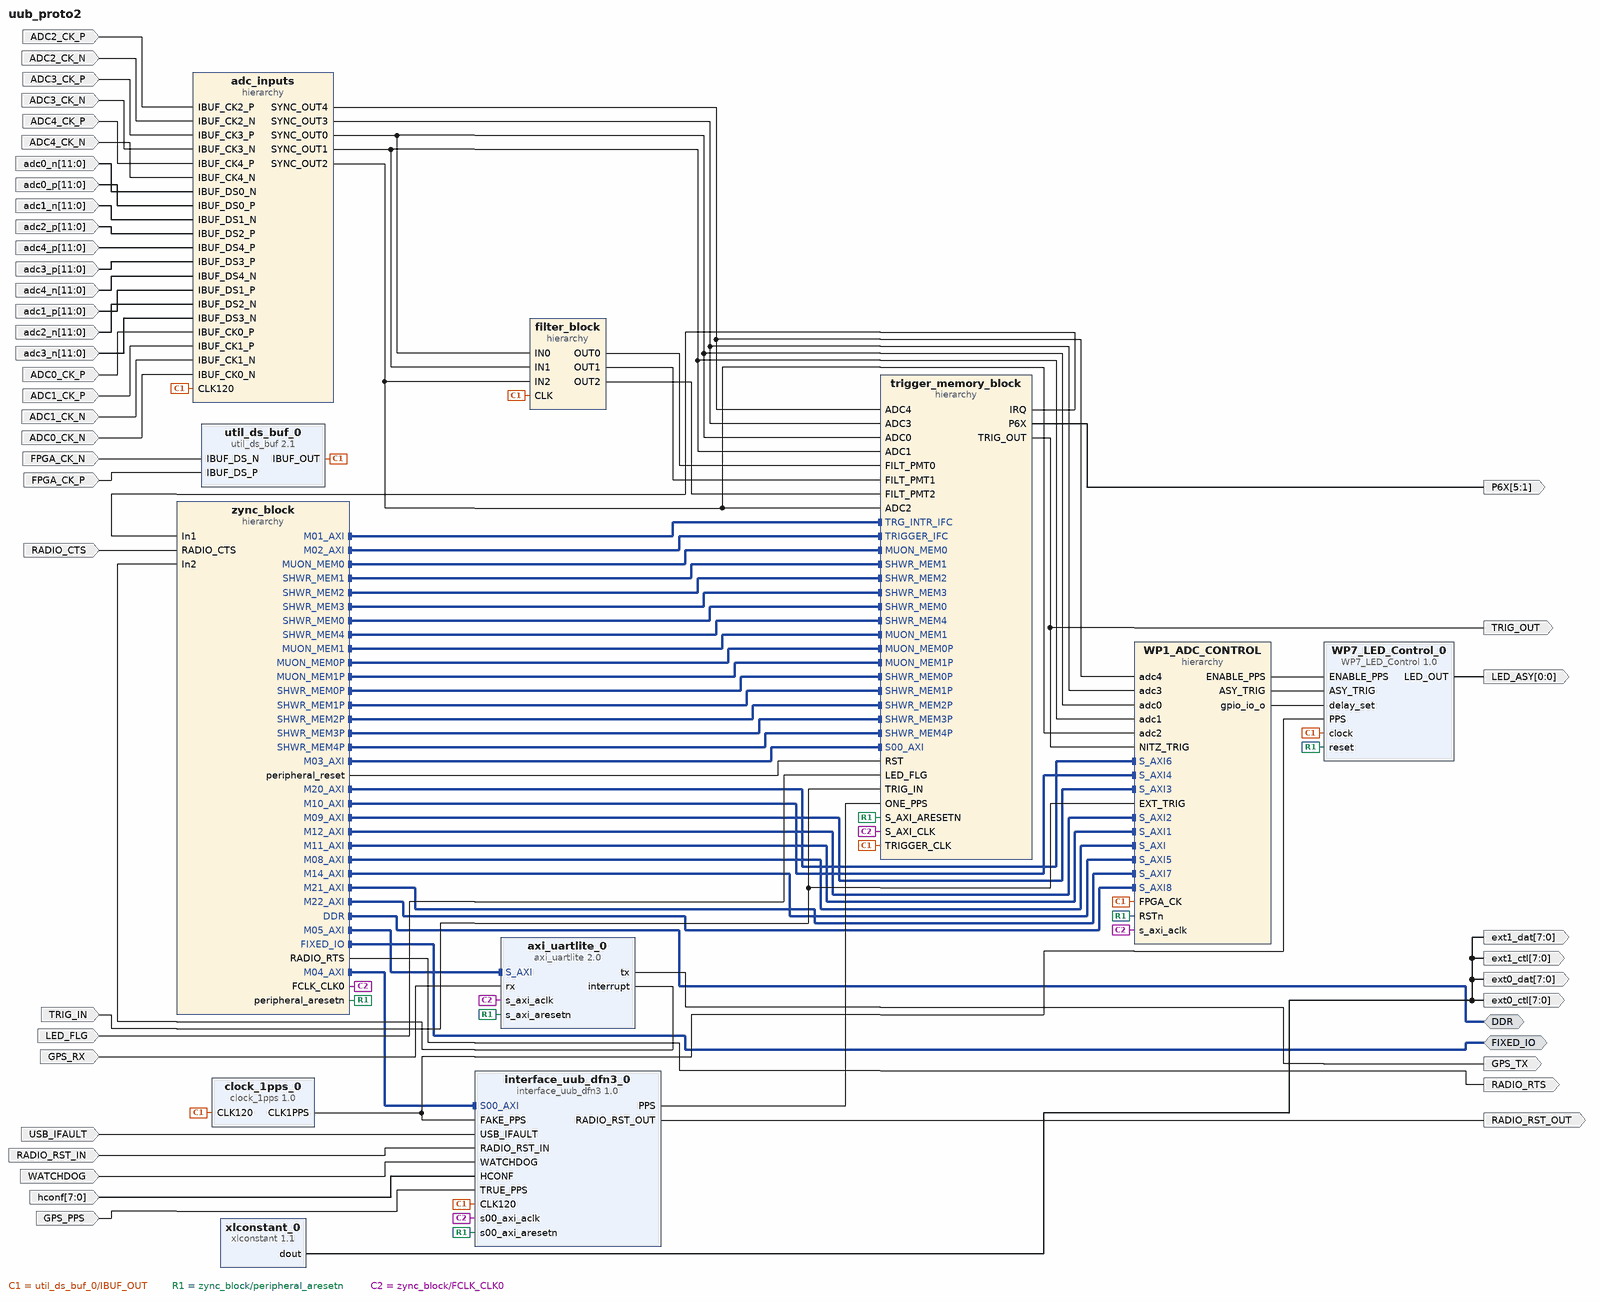
[diagram p0: block diagram of the top level]
# Vivado block design uub_proto2, Vivado 2015.2.1
create_bd_design uub_proto2

create_bd_intf_port -mode Master -vlnv xilinx.com:interface:ddrx_rtl:1.0 DDR
create_bd_intf_port -mode Master -vlnv xilinx.com:display_processing_system7:fixedio_rtl:1.0 FIXED_IO
create_bd_port -dir I -type clk FPGA_CK_N
set_property -dict {CONFIG.FREQ_HZ 120000000} [get_bd_ports FPGA_CK_N]
create_bd_port -dir I -type clk FPGA_CK_P
set_property -dict {CONFIG.FREQ_HZ 120000000} [get_bd_ports FPGA_CK_P]
create_bd_port -dir I RADIO_CTS
create_bd_port -dir O GPS_TX
create_bd_port -dir I GPS_RX
create_bd_port -dir O RADIO_RTS
create_bd_port -dir I -type clk ADC2_CK_P
set_property -dict {CONFIG.FREQ_HZ 120000000} [get_bd_ports ADC2_CK_P]
create_bd_port -dir I -type clk ADC2_CK_N
set_property -dict {CONFIG.FREQ_HZ 120000000} [get_bd_ports ADC2_CK_N]
create_bd_port -dir I -type clk ADC3_CK_P
set_property -dict {CONFIG.FREQ_HZ 120000000} [get_bd_ports ADC3_CK_P]
create_bd_port -dir I -type clk ADC3_CK_N
set_property -dict {CONFIG.FREQ_HZ 120000000} [get_bd_ports ADC3_CK_N]
create_bd_port -dir I -type clk ADC4_CK_P
set_property -dict {CONFIG.FREQ_HZ 120000000} [get_bd_ports ADC4_CK_P]
create_bd_port -dir I -type clk ADC4_CK_N
set_property -dict {CONFIG.FREQ_HZ 120000000} [get_bd_ports ADC4_CK_N]
create_bd_port -dir I -from 11 -to 0 adc0_n
create_bd_port -dir I -from 11 -to 0 adc0_p
create_bd_port -dir I -from 11 -to 0 -type data adc1_n
create_bd_port -dir I -from 11 -to 0 -type data adc2_p
create_bd_port -dir I -from 11 -to 0 -type data adc4_p
create_bd_port -dir I -from 11 -to 0 -type data adc3_p
create_bd_port -dir I -from 11 -to 0 -type data adc4_n
create_bd_port -dir I -from 11 -to 0 -type data adc1_p
create_bd_port -dir I -from 11 -to 0 -type data adc2_n
create_bd_port -dir I -from 11 -to 0 -type data adc3_n
create_bd_port -dir I TRIG_IN
create_bd_port -dir I -type clk ADC0_CK_P
set_property -dict {CONFIG.FREQ_HZ 120000000} [get_bd_ports ADC0_CK_P]
create_bd_port -dir I -type clk ADC1_CK_P
set_property -dict {CONFIG.FREQ_HZ 120000000} [get_bd_ports ADC1_CK_P]
create_bd_port -dir I -type clk ADC1_CK_N
set_property -dict {CONFIG.FREQ_HZ 120000000} [get_bd_ports ADC1_CK_N]
create_bd_port -dir I -type clk ADC0_CK_N
set_property -dict {CONFIG.FREQ_HZ 120000000} [get_bd_ports ADC0_CK_N]
create_bd_port -dir O -from 7 -to 0 ext1_ctl
create_bd_port -dir O -from 7 -to 0 ext0_ctl
create_bd_port -dir O -from 7 -to 0 ext1_dat
create_bd_port -dir O -from 7 -to 0 ext0_dat
create_bd_port -dir O -from 5 -to 1 P6X
create_bd_port -dir I USB_IFAULT
create_bd_port -dir I RADIO_RST_IN
create_bd_port -dir I WATCHDOG
create_bd_port -dir I -from 7 -to 0 hconf
create_bd_port -dir O RADIO_RST_OUT
create_bd_port -dir I GPS_PPS
create_bd_port -dir O -from 0 -to 0 LED_ASY
create_bd_port -dir I LED_FLG
create_bd_port -dir O TRIG_OUT

create_bd_cell -type hier zync_block
create_bd_cell -type ip -vlnv xilinx.com:ip:axi_uartlite:2.0 axi_uartlite_0
create_bd_cell -type ip -vlnv auger.org:dfnitz:clock_1pps:1.0 clock_1pps_0
create_bd_cell -type ip -vlnv xilinx.com:ip:util_ds_buf:2.1 util_ds_buf_0
set_property -dict {CONFIG.C_BUF_TYPE IBUFDS} [get_bd_cells util_ds_buf_0]
create_bd_cell -type hier adc_inputs
create_bd_cell -type hier trigger_memory_block
create_bd_cell -type ip -vlnv xilinx.com:ip:xlconstant:1.1 xlconstant_0
set_property -dict {CONFIG.CONST_WIDTH 8 CONFIG.CONST_VAL 170} [get_bd_cells xlconstant_0]
create_bd_cell -type hier filter_block
create_bd_cell -type ip -vlnv auger.org:auger:interface_uub_dfn3:1.0 interface_uub_dfn3_0
create_bd_cell -type hier WP1_ADC_CONTROL
create_bd_cell -type ip -vlnv elettronica.le.infn.it:user:WP7_LED_Control:1.0 WP7_LED_Control_0

# ---- hierarchy /zync_block ----
current_bd_instance /zync_block
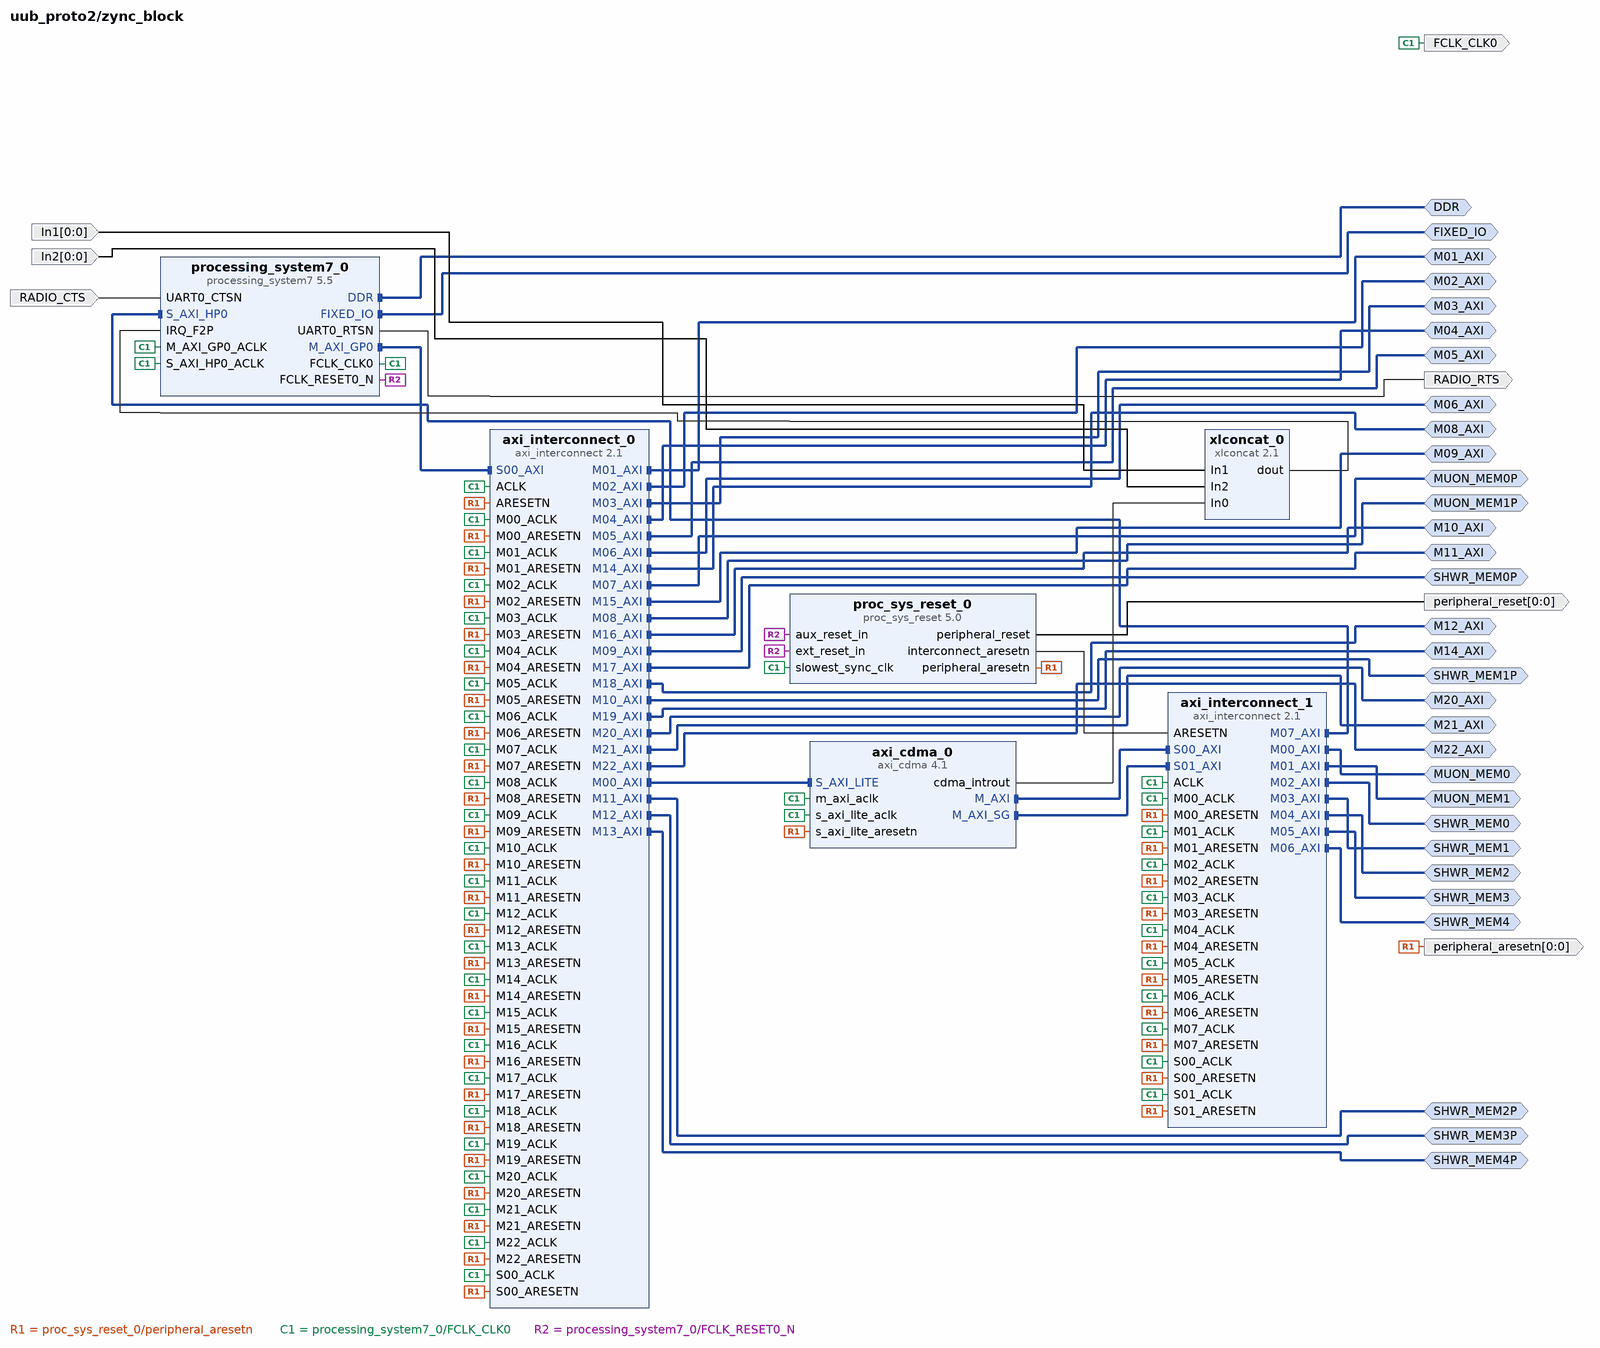
[diagram p1: block diagram inside /zync_block]
create_bd_intf_pin -mode Master -vlnv xilinx.com:interface:ddrx_rtl:1.0 DDR
create_bd_intf_pin -mode Master -vlnv xilinx.com:display_processing_system7:fixedio_rtl:1.0 FIXED_IO
create_bd_intf_pin -mode Master -vlnv xilinx.com:interface:aximm_rtl:1.0 M01_AXI
create_bd_intf_pin -mode Master -vlnv xilinx.com:interface:aximm_rtl:1.0 MUON_MEM0
create_bd_intf_pin -mode Master -vlnv xilinx.com:interface:aximm_rtl:1.0 M02_AXI
create_bd_intf_pin -mode Master -vlnv xilinx.com:interface:aximm_rtl:1.0 SHWR_MEM0
create_bd_intf_pin -mode Master -vlnv xilinx.com:interface:aximm_rtl:1.0 M03_AXI
create_bd_intf_pin -mode Master -vlnv xilinx.com:interface:aximm_rtl:1.0 SHWR_MEM1
create_bd_intf_pin -mode Master -vlnv xilinx.com:interface:aximm_rtl:1.0 M04_AXI
create_bd_intf_pin -mode Master -vlnv xilinx.com:interface:aximm_rtl:1.0 SHWR_MEM2
create_bd_intf_pin -mode Master -vlnv xilinx.com:interface:aximm_rtl:1.0 M05_AXI
create_bd_intf_pin -mode Master -vlnv xilinx.com:interface:aximm_rtl:1.0 SHWR_MEM3
create_bd_intf_pin -mode Master -vlnv xilinx.com:interface:aximm_rtl:1.0 M06_AXI
create_bd_intf_pin -mode Master -vlnv xilinx.com:interface:aximm_rtl:1.0 SHWR_MEM4
create_bd_intf_pin -mode Master -vlnv xilinx.com:interface:aximm_rtl:1.0 MUON_MEM1
create_bd_intf_pin -mode Master -vlnv xilinx.com:interface:aximm_rtl:1.0 MUON_MEM0P
create_bd_intf_pin -mode Master -vlnv xilinx.com:interface:aximm_rtl:1.0 MUON_MEM1P
create_bd_intf_pin -mode Master -vlnv xilinx.com:interface:aximm_rtl:1.0 SHWR_MEM0P
create_bd_intf_pin -mode Master -vlnv xilinx.com:interface:aximm_rtl:1.0 SHWR_MEM1P
create_bd_intf_pin -mode Master -vlnv xilinx.com:interface:aximm_rtl:1.0 SHWR_MEM2P
create_bd_intf_pin -mode Master -vlnv xilinx.com:interface:aximm_rtl:1.0 SHWR_MEM3P
create_bd_intf_pin -mode Master -vlnv xilinx.com:interface:aximm_rtl:1.0 SHWR_MEM4P
create_bd_intf_pin -mode Master -vlnv xilinx.com:interface:aximm_rtl:1.0 M08_AXI
create_bd_intf_pin -mode Master -vlnv xilinx.com:interface:aximm_rtl:1.0 M09_AXI
create_bd_intf_pin -mode Master -vlnv xilinx.com:interface:aximm_rtl:1.0 M10_AXI
create_bd_intf_pin -mode Master -vlnv xilinx.com:interface:aximm_rtl:1.0 M11_AXI
create_bd_intf_pin -mode Master -vlnv xilinx.com:interface:aximm_rtl:1.0 M12_AXI
create_bd_intf_pin -mode Master -vlnv xilinx.com:interface:aximm_rtl:1.0 M14_AXI
create_bd_intf_pin -mode Master -vlnv xilinx.com:interface:aximm_rtl:1.0 M20_AXI
create_bd_intf_pin -mode Master -vlnv xilinx.com:interface:aximm_rtl:1.0 M21_AXI
create_bd_intf_pin -mode Master -vlnv xilinx.com:interface:aximm_rtl:1.0 M22_AXI
create_bd_pin -dir O -type clk FCLK_CLK0
create_bd_pin -dir I -from 0 -to 0 In1
create_bd_pin -dir I RADIO_CTS
create_bd_pin -dir O RADIO_RTS
create_bd_pin -dir O -from 0 -to 0 -type rst peripheral_aresetn
create_bd_pin -dir O -from 0 -to 0 -type rst peripheral_reset
create_bd_pin -dir I -from 0 -to 0 In2

create_bd_cell -type ip -vlnv xilinx.com:ip:axi_interconnect:2.1 axi_interconnect_1
set_property -dict {CONFIG.NUM_SI 2 CONFIG.NUM_MI 8 CONFIG.ENABLE_ADVANCED_OPTIONS 0} [get_bd_cells axi_interconnect_1]
create_bd_cell -type ip -vlnv xilinx.com:ip:proc_sys_reset:5.0 proc_sys_reset_0
create_bd_cell -type ip -vlnv xilinx.com:ip:processing_system7:5.5 processing_system7_0
set_property -dict [list \
  CONFIG.PCW_UIPARAM_DDR_FREQ_MHZ 400 \
  CONFIG.PCW_CRYSTAL_PERIPHERAL_FREQMHZ 50 \
  CONFIG.PCW_APU_PERIPHERAL_FREQMHZ 333.5 \
  CONFIG.PCW_QSPI_PERIPHERAL_FREQMHZ 60 \
  CONFIG.PCW_SPI_PERIPHERAL_FREQMHZ 100 \
  CONFIG.PCW_FPGA0_PERIPHERAL_FREQMHZ 50 \
  CONFIG.PCW_FPGA1_PERIPHERAL_FREQMHZ 200.000000 \
  CONFIG.PCW_USE_S_AXI_HP0 1 \
  CONFIG.PCW_USE_FABRIC_INTERRUPT 1 \
  CONFIG.PCW_USE_EXPANDED_IOP 1 \
  CONFIG.PCW_UART0_BAUD_RATE 9600 \
  CONFIG.PCW_EN_CLK1_PORT 1 \
  CONFIG.PCW_IRQ_F2P_INTR 1 \
  CONFIG.PCW_IMPORT_BOARD_PRESET Z:/cao-projets/SPB16X/lagorio/Auger/Document_travail/xilinx/edk_20140221/ps7_system_prj.xml \
  CONFIG.PCW_PRESET_BANK1_VOLTAGE {LVCMOS 1.8V} \
  CONFIG.PCW_UIPARAM_DDR_MEMORY_TYPE {LPDDR 2} \
  CONFIG.PCW_UIPARAM_DDR_PARTNO Custom \
  CONFIG.PCW_QSPI_PERIPHERAL_ENABLE 1 \
  CONFIG.PCW_QSPI_GRP_SINGLE_SS_ENABLE 0 \
  CONFIG.PCW_QSPI_GRP_SS1_ENABLE 1 \
  CONFIG.PCW_ENET0_PERIPHERAL_ENABLE 1 \
  CONFIG.PCW_ENET0_ENET0_IO {MIO 16 .. 27} \
  CONFIG.PCW_ENET0_GRP_MDIO_ENABLE 1 \
  CONFIG.PCW_ENET0_RESET_ENABLE 1 \
  CONFIG.PCW_ENET0_RESET_IO {MIO 50} \
  CONFIG.PCW_UART0_PERIPHERAL_ENABLE 1 \
  CONFIG.PCW_UART0_UART0_IO {MIO 46 .. 47} \
  CONFIG.PCW_UART0_GRP_FULL_ENABLE 1 \
  CONFIG.PCW_UART1_PERIPHERAL_ENABLE 1 \
  CONFIG.PCW_UART1_UART1_IO {MIO 8 .. 9} \
  CONFIG.PCW_SPI0_PERIPHERAL_ENABLE 1 \
  CONFIG.PCW_SPI0_SPI0_IO {MIO 40 .. 45} \
  CONFIG.PCW_SPI0_GRP_SS1_ENABLE 1 \
  CONFIG.PCW_SPI0_GRP_SS2_ENABLE 1 \
  CONFIG.PCW_SPI1_PERIPHERAL_ENABLE 1 \
  CONFIG.PCW_SPI1_SPI1_IO {MIO 10 .. 15} \
  CONFIG.PCW_TTC0_PERIPHERAL_ENABLE 1 \
  CONFIG.PCW_USB0_PERIPHERAL_ENABLE 1 \
  CONFIG.PCW_USB0_RESET_ENABLE 1 \
  CONFIG.PCW_USB0_RESET_IO {MIO 51} \
  CONFIG.PCW_I2C0_PERIPHERAL_ENABLE 1 \
  CONFIG.PCW_I2C0_I2C0_IO {MIO 14 .. 15} \
  CONFIG.PCW_I2C1_PERIPHERAL_ENABLE 1 \
  CONFIG.PCW_I2C1_I2C1_IO {MIO 48 .. 49} \
  CONFIG.PCW_I2C_RESET_ENABLE 0 \
  CONFIG.PCW_GPIO_MIO_GPIO_ENABLE 1 \
] [get_bd_cells processing_system7_0]
# 82 more settings of processing_system7_0 are not shown: defaults, MIO pin electricals, DDR timing, and values the tool derives
create_bd_cell -type ip -vlnv xilinx.com:ip:xlconcat:2.1 xlconcat_0
set_property -dict {CONFIG.NUM_PORTS 3} [get_bd_cells xlconcat_0]
create_bd_cell -type ip -vlnv xilinx.com:ip:axi_cdma:4.1 axi_cdma_0
create_bd_cell -type ip -vlnv xilinx.com:ip:axi_interconnect:2.1 axi_interconnect_0
set_property -dict {CONFIG.NUM_MI 23} [get_bd_cells axi_interconnect_0]

# ---- hierarchy /adc_inputs ----
current_bd_instance /adc_inputs
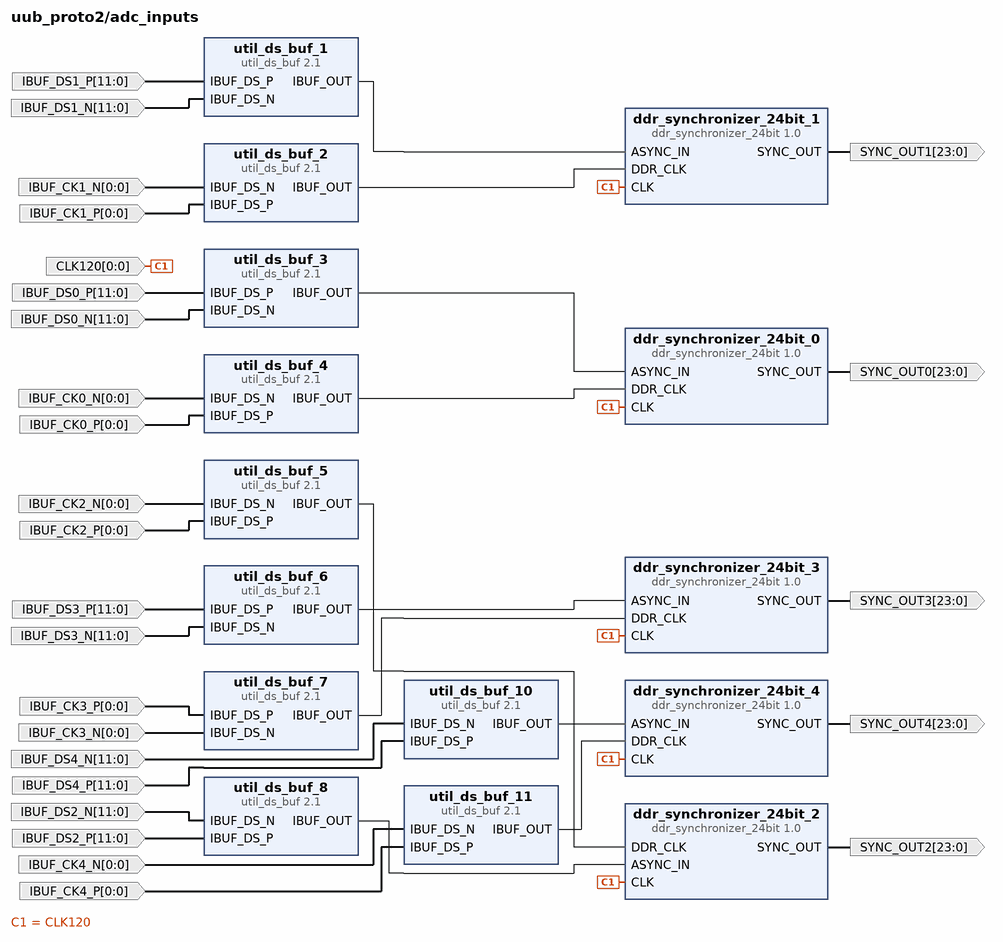
[diagram p2: block diagram inside /adc_inputs]
create_bd_pin -dir I -from 0 -to 0 -type clk CLK120
create_bd_pin -dir I -from 11 -to 0 IBUF_DS2_N
create_bd_pin -dir I -from 11 -to 0 IBUF_DS1_P
create_bd_pin -dir I -from 11 -to 0 IBUF_DS4_N
create_bd_pin -dir I -from 11 -to 0 IBUF_DS3_P
create_bd_pin -dir I -from 11 -to 0 IBUF_DS0_P
create_bd_pin -dir I -from 0 -to 0 IBUF_CK4_N
create_bd_pin -dir I -from 0 -to 0 IBUF_CK3_P
create_bd_pin -dir I -from 0 -to 0 IBUF_CK2_N
create_bd_pin -dir I -from 0 -to 0 IBUF_CK2_P
create_bd_pin -dir O -from 23 -to 0 SYNC_OUT0
create_bd_pin -dir I -from 0 -to 0 IBUF_CK1_N
create_bd_pin -dir I -from 0 -to 0 IBUF_CK4_P
create_bd_pin -dir O -from 23 -to 0 SYNC_OUT3
create_bd_pin -dir I -from 11 -to 0 IBUF_DS3_N
create_bd_pin -dir O -from 23 -to 0 SYNC_OUT1
create_bd_pin -dir I -from 11 -to 0 IBUF_DS0_N
create_bd_pin -dir I -from 0 -to 0 IBUF_CK3_N
create_bd_pin -dir O -from 23 -to 0 SYNC_OUT2
create_bd_pin -dir O -from 23 -to 0 SYNC_OUT4
create_bd_pin -dir I -from 11 -to 0 IBUF_DS2_P
create_bd_pin -dir I -from 0 -to 0 IBUF_CK0_N
create_bd_pin -dir I -from 11 -to 0 IBUF_DS1_N
create_bd_pin -dir I -from 0 -to 0 IBUF_CK1_P
create_bd_pin -dir I -from 0 -to 0 IBUF_CK0_P
create_bd_pin -dir I -from 11 -to 0 IBUF_DS4_P

create_bd_cell -type ip -vlnv xilinx.com:ip:util_ds_buf:2.1 util_ds_buf_5
create_bd_cell -type ip -vlnv xilinx.com:ip:util_ds_buf:2.1 util_ds_buf_7
create_bd_cell -type ip -vlnv xilinx.com:ip:util_ds_buf:2.1 util_ds_buf_11
create_bd_cell -type ip -vlnv xilinx.com:ip:util_ds_buf:2.1 util_ds_buf_8
set_property -dict {CONFIG.C_SIZE 12} [get_bd_cells util_ds_buf_8]
create_bd_cell -type ip -vlnv xilinx.com:ip:util_ds_buf:2.1 util_ds_buf_6
set_property -dict {CONFIG.C_SIZE 12} [get_bd_cells util_ds_buf_6]
create_bd_cell -type ip -vlnv xilinx.com:ip:util_ds_buf:2.1 util_ds_buf_10
set_property -dict {CONFIG.C_SIZE 12} [get_bd_cells util_ds_buf_10]
create_bd_cell -type ip -vlnv xilinx.com:ip:util_ds_buf:2.1 util_ds_buf_2
create_bd_cell -type ip -vlnv xilinx.com:ip:util_ds_buf:2.1 util_ds_buf_4
create_bd_cell -type ip -vlnv xilinx.com:ip:util_ds_buf:2.1 util_ds_buf_1
set_property -dict {CONFIG.C_SIZE 12} [get_bd_cells util_ds_buf_1]
create_bd_cell -type ip -vlnv xilinx.com:ip:util_ds_buf:2.1 util_ds_buf_3
set_property -dict {CONFIG.C_SIZE 12} [get_bd_cells util_ds_buf_3]
create_bd_cell -type ip -vlnv auger.org:auger:ddr_synchronizer_24bit:1.0 ddr_synchronizer_24bit_0
create_bd_cell -type ip -vlnv auger.org:auger:ddr_synchronizer_24bit:1.0 ddr_synchronizer_24bit_1
create_bd_cell -type ip -vlnv auger.org:auger:ddr_synchronizer_24bit:1.0 ddr_synchronizer_24bit_2
create_bd_cell -type ip -vlnv auger.org:auger:ddr_synchronizer_24bit:1.0 ddr_synchronizer_24bit_3
create_bd_cell -type ip -vlnv auger.org:auger:ddr_synchronizer_24bit:1.0 ddr_synchronizer_24bit_4

# ---- hierarchy /trigger_memory_block ----
current_bd_instance /trigger_memory_block
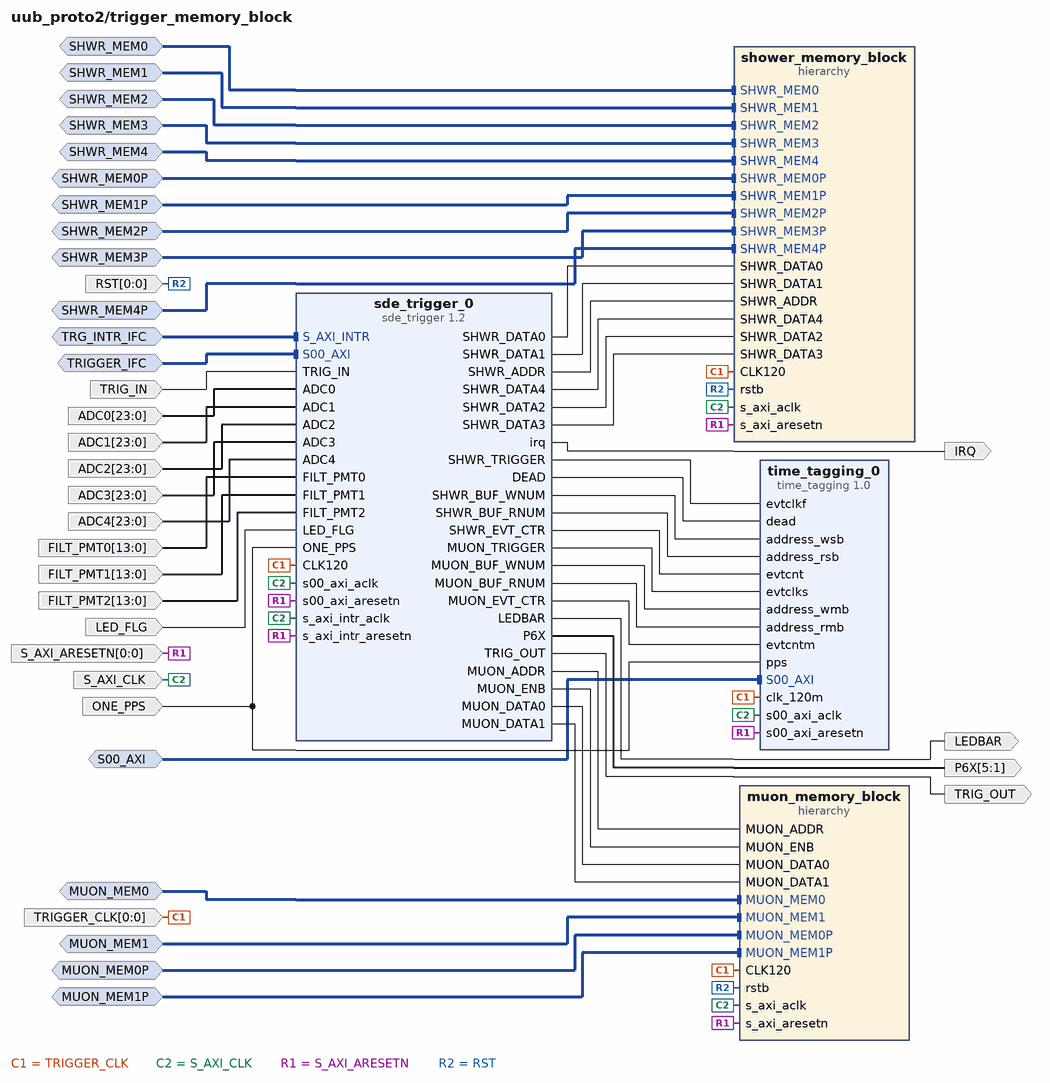
[diagram p3: block diagram inside /trigger_memory_block]
create_bd_intf_pin -mode Slave -vlnv xilinx.com:interface:aximm_rtl:1.0 MUON_MEM0
create_bd_intf_pin -mode Slave -vlnv xilinx.com:interface:aximm_rtl:1.0 SHWR_MEM0
create_bd_intf_pin -mode Slave -vlnv xilinx.com:interface:aximm_rtl:1.0 SHWR_MEM1
create_bd_intf_pin -mode Slave -vlnv xilinx.com:interface:aximm_rtl:1.0 SHWR_MEM2
create_bd_intf_pin -mode Slave -vlnv xilinx.com:interface:aximm_rtl:1.0 SHWR_MEM3
create_bd_intf_pin -mode Slave -vlnv xilinx.com:interface:aximm_rtl:1.0 TRG_INTR_IFC
create_bd_intf_pin -mode Slave -vlnv xilinx.com:interface:aximm_rtl:1.0 TRIGGER_IFC
create_bd_intf_pin -mode Slave -vlnv xilinx.com:interface:aximm_rtl:1.0 SHWR_MEM4
create_bd_intf_pin -mode Slave -vlnv xilinx.com:interface:aximm_rtl:1.0 MUON_MEM1
create_bd_intf_pin -mode Slave -vlnv xilinx.com:interface:aximm_rtl:1.0 MUON_MEM0P
create_bd_intf_pin -mode Slave -vlnv xilinx.com:interface:aximm_rtl:1.0 MUON_MEM1P
create_bd_intf_pin -mode Slave -vlnv xilinx.com:interface:aximm_rtl:1.0 SHWR_MEM0P
create_bd_intf_pin -mode Slave -vlnv xilinx.com:interface:aximm_rtl:1.0 SHWR_MEM1P
create_bd_intf_pin -mode Slave -vlnv xilinx.com:interface:aximm_rtl:1.0 SHWR_MEM2P
create_bd_intf_pin -mode Slave -vlnv xilinx.com:interface:aximm_rtl:1.0 SHWR_MEM3P
create_bd_intf_pin -mode Slave -vlnv xilinx.com:interface:aximm_rtl:1.0 SHWR_MEM4P
create_bd_intf_pin -mode Slave -vlnv xilinx.com:interface:aximm_rtl:1.0 S00_AXI
create_bd_pin -dir I -type clk S_AXI_CLK
create_bd_pin -dir I -from 0 -to 0 -type rst RST
create_bd_pin -dir I -from 0 -to 0 -type rst S_AXI_ARESETN
create_bd_pin -dir I -from 0 -to 0 TRIGGER_CLK
create_bd_pin -dir O -type intr IRQ
create_bd_pin -dir I TRIG_IN
create_bd_pin -dir O TRIG_OUT
create_bd_pin -dir I -from 23 -to 0 ADC0
create_bd_pin -dir I -from 23 -to 0 ADC1
create_bd_pin -dir I -from 23 -to 0 ADC2
create_bd_pin -dir I -from 23 -to 0 ADC3
create_bd_pin -dir I -from 23 -to 0 ADC4
create_bd_pin -dir O -from 5 -to 1 P6X
create_bd_pin -dir I -from 13 -to 0 FILT_PMT0
create_bd_pin -dir I -from 13 -to 0 FILT_PMT1
create_bd_pin -dir I -from 13 -to 0 FILT_PMT2
create_bd_pin -dir I ONE_PPS
create_bd_pin -dir I LED_FLG
create_bd_pin -dir O LEDBAR

create_bd_cell -type hier muon_memory_block
create_bd_cell -type hier shower_memory_block
create_bd_cell -type ip -vlnv auger.mtu.edu:user:sde_trigger:1.2 sde_trigger_0
create_bd_cell -type ip -vlnv xilinx.com:user:time_tagging:1.0 time_tagging_0

# ---- hierarchy /trigger_memory_block/muon_memory_block ----
current_bd_instance /trigger_memory_block/muon_memory_block
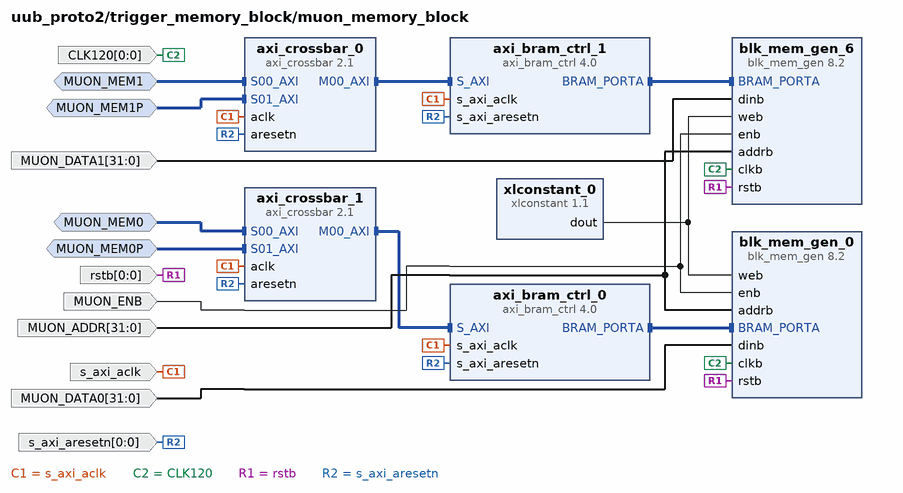
[diagram p4: block diagram inside /trigger_memory_block/muon_memory_block]
create_bd_intf_pin -mode Slave -vlnv xilinx.com:interface:aximm_rtl:1.0 MUON_MEM0
create_bd_intf_pin -mode Slave -vlnv xilinx.com:interface:aximm_rtl:1.0 MUON_MEM1
create_bd_intf_pin -mode Slave -vlnv xilinx.com:interface:aximm_rtl:1.0 MUON_MEM0P
create_bd_intf_pin -mode Slave -vlnv xilinx.com:interface:aximm_rtl:1.0 MUON_MEM1P
create_bd_pin -dir I -type clk s_axi_aclk
create_bd_pin -dir I -from 0 -to 0 CLK120
create_bd_pin -dir I MUON_ENB
create_bd_pin -dir I -from 31 -to 0 MUON_ADDR
create_bd_pin -dir I -from 0 -to 0 -type rst s_axi_aresetn
create_bd_pin -dir I -from 31 -to 0 MUON_DATA1
create_bd_pin -dir I -from 31 -to 0 MUON_DATA0
create_bd_pin -dir I -from 0 -to 0 rstb

create_bd_cell -type ip -vlnv xilinx.com:ip:axi_bram_ctrl:4.0 axi_bram_ctrl_0
set_property -dict {CONFIG.SINGLE_PORT_BRAM 1} [get_bd_cells axi_bram_ctrl_0]
create_bd_cell -type ip -vlnv xilinx.com:ip:axi_bram_ctrl:4.0 axi_bram_ctrl_1
set_property -dict {CONFIG.SINGLE_PORT_BRAM 1} [get_bd_cells axi_bram_ctrl_1]
create_bd_cell -type ip -vlnv xilinx.com:ip:blk_mem_gen:8.2 blk_mem_gen_0
set_property -dict [list \
  CONFIG.Memory_Type True_Dual_Port_RAM \
  CONFIG.Enable_B Use_ENB_Pin \
  CONFIG.Use_RSTB_Pin true \
  CONFIG.Port_B_Clock 100 \
  CONFIG.Port_B_Write_Rate 50 \
  CONFIG.Port_B_Enable_Rate 100 \
] [get_bd_cells blk_mem_gen_0]
create_bd_cell -type ip -vlnv xilinx.com:ip:blk_mem_gen:8.2 blk_mem_gen_6
set_property -dict [list \
  CONFIG.Memory_Type True_Dual_Port_RAM \
  CONFIG.Enable_B Use_ENB_Pin \
  CONFIG.Use_RSTB_Pin true \
  CONFIG.Port_B_Clock 100 \
  CONFIG.Port_B_Write_Rate 50 \
  CONFIG.Port_B_Enable_Rate 100 \
] [get_bd_cells blk_mem_gen_6]
create_bd_cell -type ip -vlnv xilinx.com:ip:xlconstant:1.1 xlconstant_0
set_property -dict {CONFIG.CONST_WIDTH 4 CONFIG.CONST_VAL 15} [get_bd_cells xlconstant_0]
create_bd_cell -type ip -vlnv xilinx.com:ip:axi_crossbar:2.1 axi_crossbar_0
set_property -dict {CONFIG.NUM_SI 2 CONFIG.NUM_MI 1 CONFIG.DATA_WIDTH 32} [get_bd_cells axi_crossbar_0]
create_bd_cell -type ip -vlnv xilinx.com:ip:axi_crossbar:2.1 axi_crossbar_1
set_property -dict {CONFIG.NUM_SI 2 CONFIG.NUM_MI 1 CONFIG.DATA_WIDTH 32} [get_bd_cells axi_crossbar_1]

# ---- hierarchy /trigger_memory_block/shower_memory_block ----
current_bd_instance /trigger_memory_block/shower_memory_block
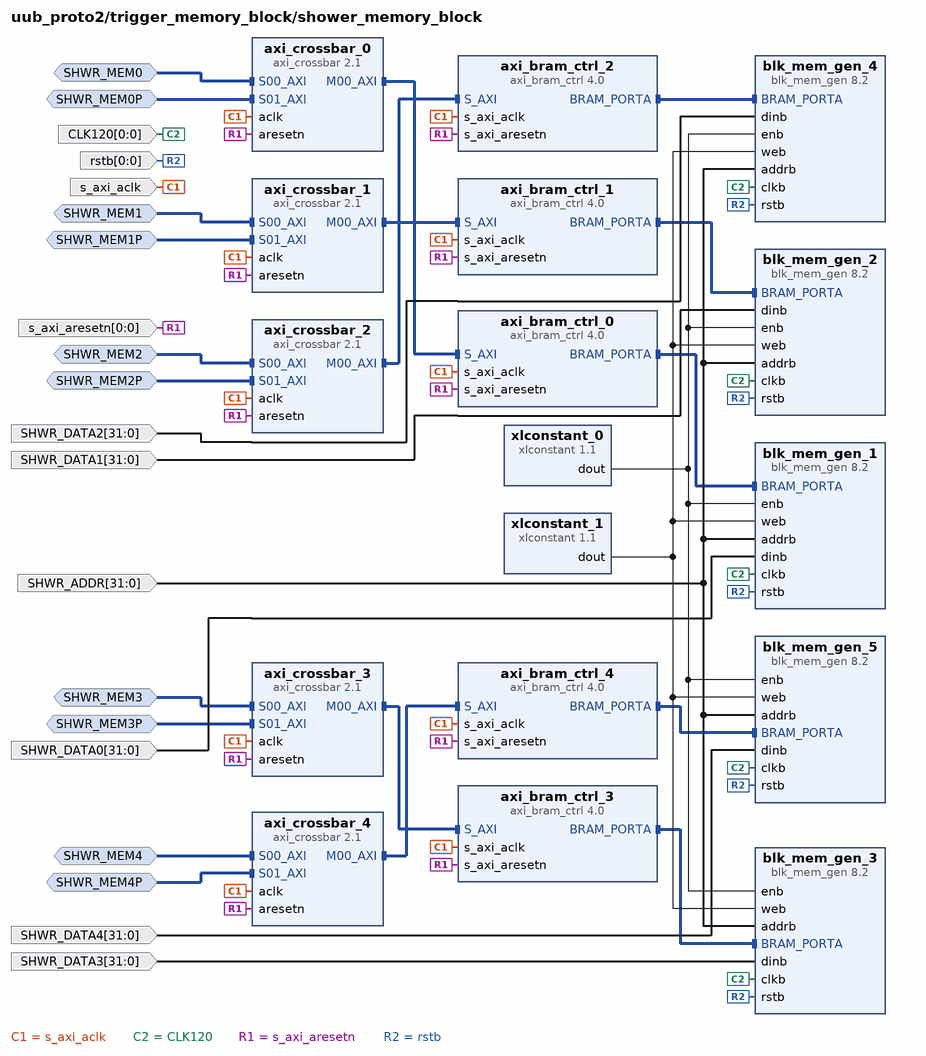
[diagram p5: block diagram inside /trigger_memory_block/shower_memory_block]
create_bd_intf_pin -mode Slave -vlnv xilinx.com:interface:aximm_rtl:1.0 SHWR_MEM0
create_bd_intf_pin -mode Slave -vlnv xilinx.com:interface:aximm_rtl:1.0 SHWR_MEM1
create_bd_intf_pin -mode Slave -vlnv xilinx.com:interface:aximm_rtl:1.0 SHWR_MEM2
create_bd_intf_pin -mode Slave -vlnv xilinx.com:interface:aximm_rtl:1.0 SHWR_MEM3
create_bd_intf_pin -mode Slave -vlnv xilinx.com:interface:aximm_rtl:1.0 SHWR_MEM4
create_bd_intf_pin -mode Slave -vlnv xilinx.com:interface:aximm_rtl:1.0 SHWR_MEM0P
create_bd_intf_pin -mode Slave -vlnv xilinx.com:interface:aximm_rtl:1.0 SHWR_MEM1P
create_bd_intf_pin -mode Slave -vlnv xilinx.com:interface:aximm_rtl:1.0 SHWR_MEM2P
create_bd_intf_pin -mode Slave -vlnv xilinx.com:interface:aximm_rtl:1.0 SHWR_MEM3P
create_bd_intf_pin -mode Slave -vlnv xilinx.com:interface:aximm_rtl:1.0 SHWR_MEM4P
create_bd_pin -dir I -type clk s_axi_aclk
create_bd_pin -dir I -from 0 -to 0 CLK120
create_bd_pin -dir I -from 31 -to 0 SHWR_DATA1
create_bd_pin -dir I -from 31 -to 0 SHWR_DATA0
create_bd_pin -dir I -from 31 -to 0 SHWR_ADDR
create_bd_pin -dir I -from 31 -to 0 SHWR_DATA2
create_bd_pin -dir I -from 31 -to 0 SHWR_DATA3
create_bd_pin -dir I -from 0 -to 0 -type rst s_axi_aresetn
create_bd_pin -dir I -from 0 -to 0 rstb
create_bd_pin -dir I -from 31 -to 0 SHWR_DATA4

create_bd_cell -type ip -vlnv xilinx.com:ip:blk_mem_gen:8.2 blk_mem_gen_5
set_property -dict [list \
  CONFIG.Memory_Type True_Dual_Port_RAM \
  CONFIG.Enable_B Use_ENB_Pin \
  CONFIG.Use_RSTB_Pin true \
  CONFIG.Port_B_Clock 100 \
  CONFIG.Port_B_Write_Rate 50 \
  CONFIG.Port_B_Enable_Rate 100 \
] [get_bd_cells blk_mem_gen_5]
create_bd_cell -type ip -vlnv xilinx.com:ip:axi_bram_ctrl:4.0 axi_bram_ctrl_0
set_property -dict {CONFIG.SINGLE_PORT_BRAM 1} [get_bd_cells axi_bram_ctrl_0]
create_bd_cell -type ip -vlnv xilinx.com:ip:axi_bram_ctrl:4.0 axi_bram_ctrl_1
set_property -dict {CONFIG.SINGLE_PORT_BRAM 1} [get_bd_cells axi_bram_ctrl_1]
create_bd_cell -type ip -vlnv xilinx.com:ip:axi_bram_ctrl:4.0 axi_bram_ctrl_2
set_property -dict {CONFIG.SINGLE_PORT_BRAM 1} [get_bd_cells axi_bram_ctrl_2]
create_bd_cell -type ip -vlnv xilinx.com:ip:xlconstant:1.1 xlconstant_0
create_bd_cell -type ip -vlnv xilinx.com:ip:xlconstant:1.1 xlconstant_1
set_property -dict {CONFIG.CONST_WIDTH 4 CONFIG.CONST_VAL 15} [get_bd_cells xlconstant_1]
create_bd_cell -type ip -vlnv xilinx.com:ip:axi_bram_ctrl:4.0 axi_bram_ctrl_3
set_property -dict {CONFIG.SINGLE_PORT_BRAM 1} [get_bd_cells axi_bram_ctrl_3]
create_bd_cell -type ip -vlnv xilinx.com:ip:axi_bram_ctrl:4.0 axi_bram_ctrl_4
set_property -dict {CONFIG.SINGLE_PORT_BRAM 1} [get_bd_cells axi_bram_ctrl_4]
create_bd_cell -type ip -vlnv xilinx.com:ip:blk_mem_gen:8.2 blk_mem_gen_1
set_property -dict [list \
  CONFIG.Memory_Type True_Dual_Port_RAM \
  CONFIG.Enable_B Use_ENB_Pin \
  CONFIG.Use_RSTB_Pin true \
  CONFIG.Port_B_Clock 100 \
  CONFIG.Port_B_Write_Rate 50 \
  CONFIG.Port_B_Enable_Rate 100 \
] [get_bd_cells blk_mem_gen_1]
create_bd_cell -type ip -vlnv xilinx.com:ip:blk_mem_gen:8.2 blk_mem_gen_2
set_property -dict [list \
  CONFIG.Memory_Type True_Dual_Port_RAM \
  CONFIG.Enable_B Use_ENB_Pin \
  CONFIG.Use_RSTB_Pin true \
  CONFIG.Port_B_Clock 100 \
  CONFIG.Port_B_Write_Rate 50 \
  CONFIG.Port_B_Enable_Rate 100 \
] [get_bd_cells blk_mem_gen_2]
create_bd_cell -type ip -vlnv xilinx.com:ip:blk_mem_gen:8.2 blk_mem_gen_3
set_property -dict [list \
  CONFIG.Memory_Type True_Dual_Port_RAM \
  CONFIG.Enable_B Use_ENB_Pin \
  CONFIG.Use_RSTB_Pin true \
  CONFIG.Port_B_Clock 100 \
  CONFIG.Port_B_Write_Rate 50 \
  CONFIG.Port_B_Enable_Rate 100 \
] [get_bd_cells blk_mem_gen_3]
create_bd_cell -type ip -vlnv xilinx.com:ip:blk_mem_gen:8.2 blk_mem_gen_4
set_property -dict [list \
  CONFIG.Memory_Type True_Dual_Port_RAM \
  CONFIG.Enable_B Use_ENB_Pin \
  CONFIG.Use_RSTB_Pin true \
  CONFIG.Port_B_Clock 100 \
  CONFIG.Port_B_Write_Rate 50 \
  CONFIG.Port_B_Enable_Rate 100 \
] [get_bd_cells blk_mem_gen_4]
create_bd_cell -type ip -vlnv xilinx.com:ip:axi_crossbar:2.1 axi_crossbar_0
set_property -dict {CONFIG.NUM_SI 2 CONFIG.NUM_MI 1 CONFIG.DATA_WIDTH 32} [get_bd_cells axi_crossbar_0]
create_bd_cell -type ip -vlnv xilinx.com:ip:axi_crossbar:2.1 axi_crossbar_1
set_property -dict {CONFIG.NUM_SI 2 CONFIG.NUM_MI 1 CONFIG.DATA_WIDTH 32} [get_bd_cells axi_crossbar_1]
create_bd_cell -type ip -vlnv xilinx.com:ip:axi_crossbar:2.1 axi_crossbar_2
set_property -dict {CONFIG.NUM_SI 2 CONFIG.NUM_MI 1 CONFIG.DATA_WIDTH 32} [get_bd_cells axi_crossbar_2]
create_bd_cell -type ip -vlnv xilinx.com:ip:axi_crossbar:2.1 axi_crossbar_3
set_property -dict {CONFIG.NUM_SI 2 CONFIG.NUM_MI 1 CONFIG.DATA_WIDTH 32} [get_bd_cells axi_crossbar_3]
create_bd_cell -type ip -vlnv xilinx.com:ip:axi_crossbar:2.1 axi_crossbar_4
set_property -dict {CONFIG.NUM_SI 2 CONFIG.NUM_MI 1 CONFIG.DATA_WIDTH 32} [get_bd_cells axi_crossbar_4]

# ---- hierarchy /filter_block ----
current_bd_instance /filter_block
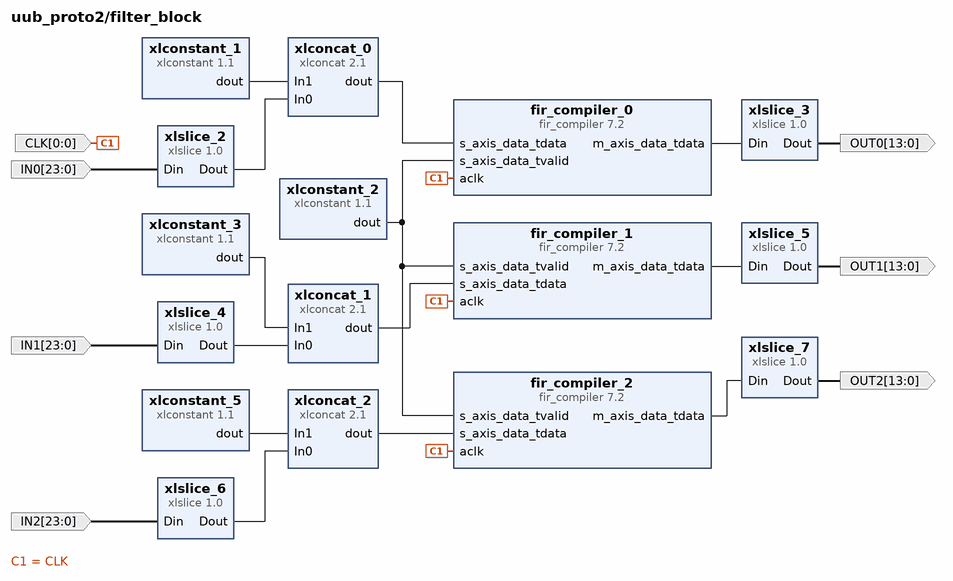
[diagram p6: block diagram inside /filter_block]
create_bd_pin -dir I -from 23 -to 0 IN0
create_bd_pin -dir O -from 13 -to 0 OUT0
create_bd_pin -dir I -from 23 -to 0 IN1
create_bd_pin -dir O -from 13 -to 0 OUT1
create_bd_pin -dir I -from 23 -to 0 IN2
create_bd_pin -dir O -from 13 -to 0 OUT2
create_bd_pin -dir I -from 0 -to 0 CLK

create_bd_cell -type ip -vlnv xilinx.com:ip:fir_compiler:7.2 fir_compiler_0
set_property -dict [list \
  CONFIG.CoefficientVector 5,0,12,22,0,-61,-96,0,256,551,681,551,256,0,-96,-61,0,22,12,0,5 \
  CONFIG.Coefficient_Sets 1 \
  CONFIG.Channel_Sequence Basic \
  CONFIG.Number_Channels 1 \
  CONFIG.Select_Pattern All \
  CONFIG.RateSpecification Input_Sample_Period \
  CONFIG.SamplePeriod 1 \
  CONFIG.Coefficient_Sign Signed \
  CONFIG.Quantization Integer_Coefficients \
  CONFIG.Coefficient_Width 11 \
  CONFIG.Coefficient_Fractional_Bits 0 \
  CONFIG.Coefficient_Structure Inferred \
  CONFIG.Data_Sign Unsigned \
  CONFIG.Data_Width 12 \
  CONFIG.Data_Fractional_Bits 0 \
  CONFIG.Output_Rounding_Mode Convergent_Rounding_to_Even \
  CONFIG.Output_Width 24 \
  CONFIG.Filter_Architecture Systolic_Multiply_Accumulate \
  CONFIG.ColumnConfig 11 \
  CONFIG.DATA_Has_TLAST Not_Required \
  CONFIG.S_DATA_Has_TUSER Not_Required \
  CONFIG.M_DATA_Has_TUSER Not_Required \
] [get_bd_cells fir_compiler_0]
create_bd_cell -type ip -vlnv xilinx.com:ip:xlconcat:2.1 xlconcat_0
set_property -dict {CONFIG.IN0_WIDTH 12 CONFIG.IN1_WIDTH 4} [get_bd_cells xlconcat_0]
create_bd_cell -type ip -vlnv xilinx.com:ip:xlconstant:1.1 xlconstant_1
set_property -dict {CONFIG.CONST_WIDTH 4 CONFIG.CONST_VAL 0} [get_bd_cells xlconstant_1]
create_bd_cell -type ip -vlnv xilinx.com:ip:xlconstant:1.1 xlconstant_2
create_bd_cell -type ip -vlnv xilinx.com:ip:xlslice:1.0 xlslice_2
set_property -dict {CONFIG.DOUT_WIDTH 12 CONFIG.DIN_TO 12 CONFIG.DIN_FROM 23 CONFIG.DIN_WIDTH 24} [get_bd_cells xlslice_2]
create_bd_cell -type ip -vlnv xilinx.com:ip:xlslice:1.0 xlslice_3
set_property -dict {CONFIG.DOUT_WIDTH 14 CONFIG.DIN_TO 10 CONFIG.DIN_FROM 23 CONFIG.DIN_WIDTH 24} [get_bd_cells xlslice_3]
create_bd_cell -type ip -vlnv xilinx.com:ip:fir_compiler:7.2 fir_compiler_1
set_property -dict [list \
  CONFIG.CoefficientVector 5,0,12,22,0,-61,-96,0,256,551,681,551,256,0,-96,-61,0,22,12,0,5 \
  CONFIG.Coefficient_Sets 1 \
  CONFIG.Channel_Sequence Basic \
  CONFIG.Number_Channels 1 \
  CONFIG.Select_Pattern All \
  CONFIG.RateSpecification Input_Sample_Period \
  CONFIG.SamplePeriod 1 \
  CONFIG.Coefficient_Sign Signed \
  CONFIG.Quantization Integer_Coefficients \
  CONFIG.Coefficient_Width 11 \
  CONFIG.Coefficient_Fractional_Bits 0 \
  CONFIG.Coefficient_Structure Inferred \
  CONFIG.Data_Sign Unsigned \
  CONFIG.Data_Width 12 \
  CONFIG.Data_Fractional_Bits 0 \
  CONFIG.Output_Rounding_Mode Convergent_Rounding_to_Even \
  CONFIG.Output_Width 24 \
  CONFIG.Filter_Architecture Systolic_Multiply_Accumulate \
  CONFIG.ColumnConfig 11 \
  CONFIG.DATA_Has_TLAST Not_Required \
  CONFIG.S_DATA_Has_TUSER Not_Required \
  CONFIG.M_DATA_Has_TUSER Not_Required \
] [get_bd_cells fir_compiler_1]
create_bd_cell -type ip -vlnv xilinx.com:ip:xlconcat:2.1 xlconcat_1
set_property -dict {CONFIG.IN0_WIDTH 12 CONFIG.IN1_WIDTH 4} [get_bd_cells xlconcat_1]
create_bd_cell -type ip -vlnv xilinx.com:ip:xlconstant:1.1 xlconstant_3
set_property -dict {CONFIG.CONST_WIDTH 4 CONFIG.CONST_VAL 0} [get_bd_cells xlconstant_3]
create_bd_cell -type ip -vlnv xilinx.com:ip:xlslice:1.0 xlslice_4
set_property -dict {CONFIG.DOUT_WIDTH 12 CONFIG.DIN_TO 12 CONFIG.DIN_FROM 23 CONFIG.DIN_WIDTH 24} [get_bd_cells xlslice_4]
create_bd_cell -type ip -vlnv xilinx.com:ip:xlslice:1.0 xlslice_5
set_property -dict {CONFIG.DOUT_WIDTH 14 CONFIG.DIN_TO 10 CONFIG.DIN_FROM 23 CONFIG.DIN_WIDTH 24} [get_bd_cells xlslice_5]
create_bd_cell -type ip -vlnv xilinx.com:ip:fir_compiler:7.2 fir_compiler_2
set_property -dict [list \
  CONFIG.CoefficientVector 5,0,12,22,0,-61,-96,0,256,551,681,551,256,0,-96,-61,0,22,12,0,5 \
  CONFIG.Coefficient_Sets 1 \
  CONFIG.Channel_Sequence Basic \
  CONFIG.Number_Channels 1 \
  CONFIG.Select_Pattern All \
  CONFIG.RateSpecification Input_Sample_Period \
  CONFIG.SamplePeriod 1 \
  CONFIG.Coefficient_Sign Signed \
  CONFIG.Quantization Integer_Coefficients \
  CONFIG.Coefficient_Width 11 \
  CONFIG.Coefficient_Fractional_Bits 0 \
  CONFIG.Coefficient_Structure Inferred \
  CONFIG.Data_Sign Unsigned \
  CONFIG.Data_Width 12 \
  CONFIG.Data_Fractional_Bits 0 \
  CONFIG.Output_Rounding_Mode Convergent_Rounding_to_Even \
  CONFIG.Output_Width 24 \
  CONFIG.Filter_Architecture Systolic_Multiply_Accumulate \
  CONFIG.ColumnConfig 11 \
  CONFIG.DATA_Has_TLAST Not_Required \
  CONFIG.S_DATA_Has_TUSER Not_Required \
  CONFIG.M_DATA_Has_TUSER Not_Required \
] [get_bd_cells fir_compiler_2]
create_bd_cell -type ip -vlnv xilinx.com:ip:xlconcat:2.1 xlconcat_2
set_property -dict {CONFIG.IN0_WIDTH 12 CONFIG.IN1_WIDTH 4} [get_bd_cells xlconcat_2]
create_bd_cell -type ip -vlnv xilinx.com:ip:xlconstant:1.1 xlconstant_5
set_property -dict {CONFIG.CONST_WIDTH 4 CONFIG.CONST_VAL 0} [get_bd_cells xlconstant_5]
create_bd_cell -type ip -vlnv xilinx.com:ip:xlslice:1.0 xlslice_6
set_property -dict {CONFIG.DOUT_WIDTH 12 CONFIG.DIN_TO 12 CONFIG.DIN_FROM 23 CONFIG.DIN_WIDTH 24} [get_bd_cells xlslice_6]
create_bd_cell -type ip -vlnv xilinx.com:ip:xlslice:1.0 xlslice_7
set_property -dict {CONFIG.DOUT_WIDTH 14 CONFIG.DIN_TO 10 CONFIG.DIN_FROM 23 CONFIG.DIN_WIDTH 24} [get_bd_cells xlslice_7]

# ---- hierarchy /WP1_ADC_CONTROL ----
current_bd_instance /WP1_ADC_CONTROL
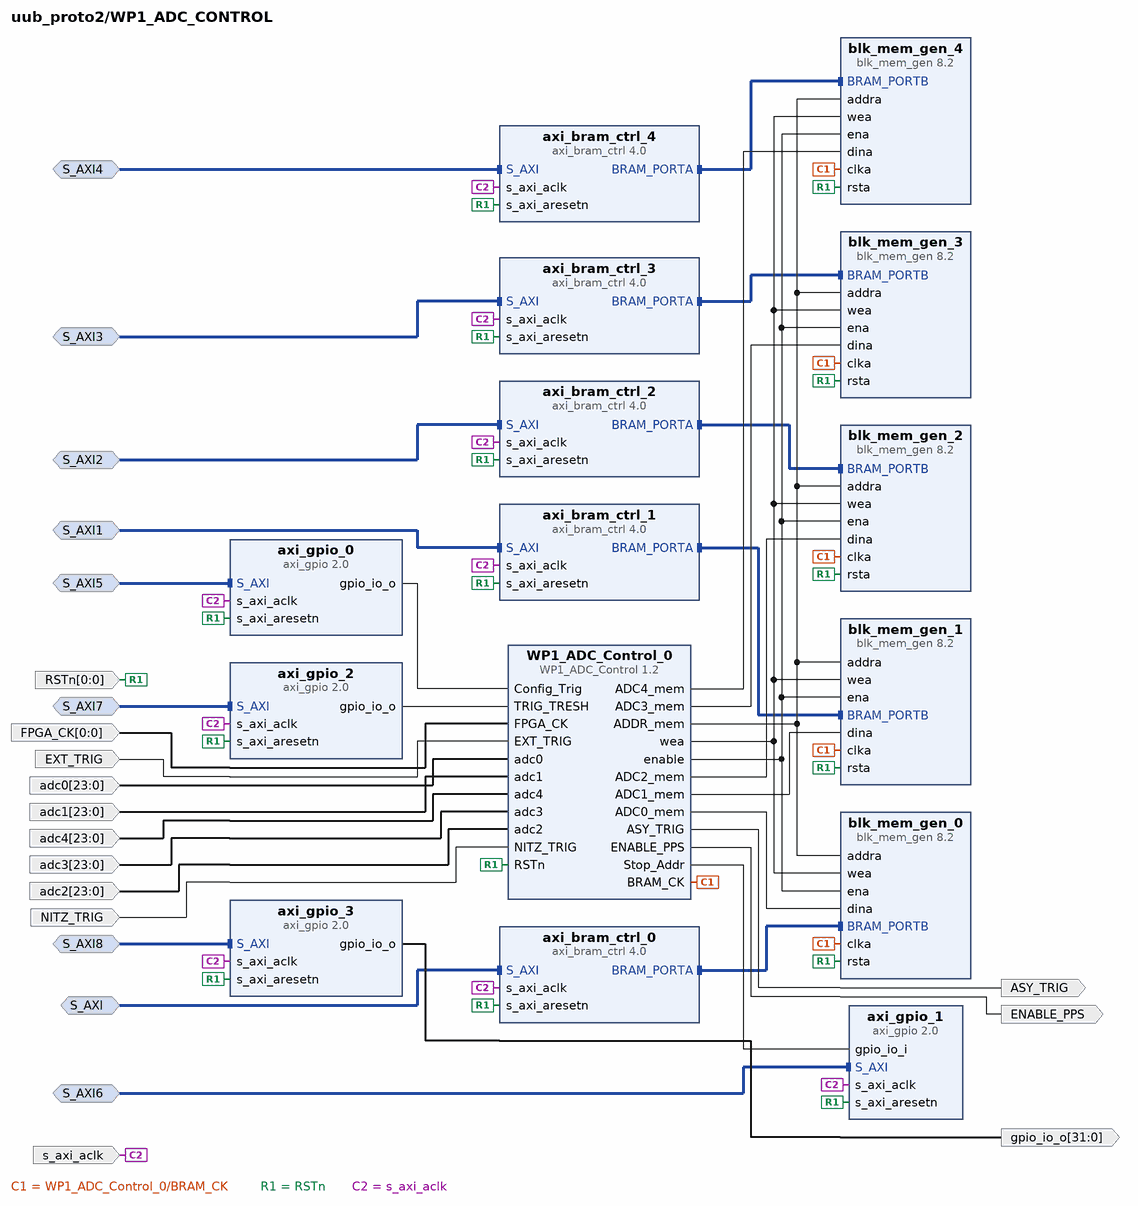
[diagram p7: block diagram inside /WP1_ADC_CONTROL]
create_bd_intf_pin -mode Slave -vlnv xilinx.com:interface:aximm_rtl:1.0 S_AXI
create_bd_intf_pin -mode Slave -vlnv xilinx.com:interface:aximm_rtl:1.0 S_AXI1
create_bd_intf_pin -mode Slave -vlnv xilinx.com:interface:aximm_rtl:1.0 S_AXI2
create_bd_intf_pin -mode Slave -vlnv xilinx.com:interface:aximm_rtl:1.0 S_AXI3
create_bd_intf_pin -mode Slave -vlnv xilinx.com:interface:aximm_rtl:1.0 S_AXI4
create_bd_intf_pin -mode Slave -vlnv xilinx.com:interface:aximm_rtl:1.0 S_AXI6
create_bd_intf_pin -mode Slave -vlnv xilinx.com:interface:aximm_rtl:1.0 S_AXI5
create_bd_intf_pin -mode Slave -vlnv xilinx.com:interface:aximm_rtl:1.0 S_AXI7
create_bd_intf_pin -mode Slave -vlnv xilinx.com:interface:aximm_rtl:1.0 S_AXI8
create_bd_pin -dir I -from 0 -to 0 FPGA_CK
create_bd_pin -dir I -from 0 -to 0 RSTn
create_bd_pin -dir I -type clk s_axi_aclk
create_bd_pin -dir I EXT_TRIG
create_bd_pin -dir I -from 23 -to 0 adc0
create_bd_pin -dir I -from 23 -to 0 adc1
create_bd_pin -dir I -from 23 -to 0 adc4
create_bd_pin -dir I -from 23 -to 0 adc3
create_bd_pin -dir I -from 23 -to 0 adc2
create_bd_pin -dir O ASY_TRIG
create_bd_pin -dir O ENABLE_PPS
create_bd_pin -dir O -from 31 -to 0 gpio_io_o
create_bd_pin -dir I NITZ_TRIG

create_bd_cell -type ip -vlnv xilinx.com:ip:axi_bram_ctrl:4.0 axi_bram_ctrl_0
set_property -dict {CONFIG.SINGLE_PORT_BRAM 1} [get_bd_cells axi_bram_ctrl_0]
create_bd_cell -type ip -vlnv xilinx.com:ip:axi_bram_ctrl:4.0 axi_bram_ctrl_1
set_property -dict {CONFIG.SINGLE_PORT_BRAM 1} [get_bd_cells axi_bram_ctrl_1]
create_bd_cell -type ip -vlnv xilinx.com:ip:axi_bram_ctrl:4.0 axi_bram_ctrl_2
set_property -dict {CONFIG.SINGLE_PORT_BRAM 1} [get_bd_cells axi_bram_ctrl_2]
create_bd_cell -type ip -vlnv xilinx.com:ip:axi_bram_ctrl:4.0 axi_bram_ctrl_3
set_property -dict {CONFIG.SINGLE_PORT_BRAM 1} [get_bd_cells axi_bram_ctrl_3]
create_bd_cell -type ip -vlnv xilinx.com:ip:axi_bram_ctrl:4.0 axi_bram_ctrl_4
set_property -dict {CONFIG.SINGLE_PORT_BRAM 1} [get_bd_cells axi_bram_ctrl_4]
create_bd_cell -type ip -vlnv xilinx.com:ip:axi_gpio:2.0 axi_gpio_1
set_property -dict {CONFIG.C_GPIO_WIDTH 16 CONFIG.C_IS_DUAL 0 CONFIG.C_ALL_INPUTS 1} [get_bd_cells axi_gpio_1]
create_bd_cell -type ip -vlnv xilinx.com:ip:blk_mem_gen:8.2 blk_mem_gen_1
set_property -dict [list \
  CONFIG.Memory_Type True_Dual_Port_RAM \
  CONFIG.Enable_B Use_ENB_Pin \
  CONFIG.Use_RSTB_Pin true \
  CONFIG.Port_B_Clock 100 \
  CONFIG.Port_B_Write_Rate 50 \
  CONFIG.Port_B_Enable_Rate 100 \
] [get_bd_cells blk_mem_gen_1]
create_bd_cell -type ip -vlnv xilinx.com:ip:blk_mem_gen:8.2 blk_mem_gen_3
set_property -dict [list \
  CONFIG.Memory_Type True_Dual_Port_RAM \
  CONFIG.Enable_B Use_ENB_Pin \
  CONFIG.Use_RSTB_Pin true \
  CONFIG.Port_B_Clock 100 \
  CONFIG.Port_B_Write_Rate 50 \
  CONFIG.Port_B_Enable_Rate 100 \
] [get_bd_cells blk_mem_gen_3]
create_bd_cell -type ip -vlnv xilinx.com:ip:blk_mem_gen:8.2 blk_mem_gen_4
set_property -dict [list \
  CONFIG.Memory_Type True_Dual_Port_RAM \
  CONFIG.Enable_B Use_ENB_Pin \
  CONFIG.Use_RSTB_Pin true \
  CONFIG.Port_B_Clock 100 \
  CONFIG.Port_B_Write_Rate 50 \
  CONFIG.Port_B_Enable_Rate 100 \
] [get_bd_cells blk_mem_gen_4]
create_bd_cell -type ip -vlnv xilinx.com:ip:blk_mem_gen:8.2 blk_mem_gen_2
set_property -dict [list \
  CONFIG.Memory_Type True_Dual_Port_RAM \
  CONFIG.Enable_B Use_ENB_Pin \
  CONFIG.Use_RSTB_Pin true \
  CONFIG.Port_B_Clock 100 \
  CONFIG.Port_B_Write_Rate 50 \
  CONFIG.Port_B_Enable_Rate 100 \
] [get_bd_cells blk_mem_gen_2]
create_bd_cell -type ip -vlnv xilinx.com:ip:blk_mem_gen:8.2 blk_mem_gen_0
set_property -dict [list \
  CONFIG.Memory_Type True_Dual_Port_RAM \
  CONFIG.Enable_B Use_ENB_Pin \
  CONFIG.Use_RSTB_Pin true \
  CONFIG.Port_B_Clock 100 \
  CONFIG.Port_B_Write_Rate 50 \
  CONFIG.Port_B_Enable_Rate 100 \
] [get_bd_cells blk_mem_gen_0]
create_bd_cell -type ip -vlnv xilinx.com:ip:axi_gpio:2.0 axi_gpio_0
set_property -dict {CONFIG.C_IS_DUAL 0 CONFIG.C_ALL_OUTPUTS 1} [get_bd_cells axi_gpio_0]
create_bd_cell -type ip -vlnv xilinx.com:ip:axi_gpio:2.0 axi_gpio_2
set_property -dict {CONFIG.C_ALL_OUTPUTS 1} [get_bd_cells axi_gpio_2]
create_bd_cell -type ip -vlnv xilinx.com:ip:axi_gpio:2.0 axi_gpio_3
set_property -dict {CONFIG.C_ALL_OUTPUTS 1} [get_bd_cells axi_gpio_3]
create_bd_cell -type ip -vlnv elettronica.le.infn.it:user:WP1_ADC_Control:1.2 WP1_ADC_Control_0

# ---- connections ----

current_bd_instance /zync_block
connect_bd_intf_net [get_bd_intf_pins axi_cdma_0/M_AXI] [get_bd_intf_pins axi_interconnect_1/S00_AXI]
connect_bd_intf_net [get_bd_intf_pins axi_cdma_0/M_AXI_SG] [get_bd_intf_pins axi_interconnect_1/S01_AXI]
connect_bd_intf_net [get_bd_intf_pins axi_interconnect_1/M07_AXI] [get_bd_intf_pins processing_system7_0/S_AXI_HP0]
connect_bd_intf_net [get_bd_intf_pins axi_interconnect_0/M00_AXI] [get_bd_intf_pins axi_cdma_0/S_AXI_LITE]
connect_bd_intf_net [get_bd_intf_pins processing_system7_0/M_AXI_GP0] [get_bd_intf_pins axi_interconnect_0/S00_AXI]
connect_bd_intf_net [get_bd_intf_pins DDR] [get_bd_intf_pins processing_system7_0/DDR]
connect_bd_intf_net [get_bd_intf_pins FIXED_IO] [get_bd_intf_pins processing_system7_0/FIXED_IO]
connect_bd_intf_net [get_bd_intf_pins M01_AXI] [get_bd_intf_pins axi_interconnect_0/M01_AXI]
connect_bd_intf_net [get_bd_intf_pins MUON_MEM0] [get_bd_intf_pins axi_interconnect_1/M00_AXI]
connect_bd_intf_net [get_bd_intf_pins M02_AXI] [get_bd_intf_pins axi_interconnect_0/M02_AXI]
connect_bd_intf_net [get_bd_intf_pins SHWR_MEM0] [get_bd_intf_pins axi_interconnect_1/M02_AXI]
connect_bd_intf_net [get_bd_intf_pins M03_AXI] [get_bd_intf_pins axi_interconnect_0/M03_AXI]
connect_bd_intf_net [get_bd_intf_pins SHWR_MEM1] [get_bd_intf_pins axi_interconnect_1/M03_AXI]
connect_bd_intf_net [get_bd_intf_pins M04_AXI] [get_bd_intf_pins axi_interconnect_0/M04_AXI]
connect_bd_intf_net [get_bd_intf_pins SHWR_MEM2] [get_bd_intf_pins axi_interconnect_1/M04_AXI]
connect_bd_intf_net [get_bd_intf_pins M05_AXI] [get_bd_intf_pins axi_interconnect_0/M05_AXI]
connect_bd_intf_net [get_bd_intf_pins SHWR_MEM3] [get_bd_intf_pins axi_interconnect_1/M05_AXI]
connect_bd_intf_net [get_bd_intf_pins M06_AXI] [get_bd_intf_pins axi_interconnect_0/M06_AXI]
connect_bd_intf_net [get_bd_intf_pins SHWR_MEM4] [get_bd_intf_pins axi_interconnect_1/M06_AXI]
connect_bd_intf_net [get_bd_intf_pins MUON_MEM1] [get_bd_intf_pins axi_interconnect_1/M01_AXI]
connect_bd_intf_net [get_bd_intf_pins MUON_MEM0P] [get_bd_intf_pins axi_interconnect_0/M07_AXI]
connect_bd_intf_net [get_bd_intf_pins MUON_MEM1P] [get_bd_intf_pins axi_interconnect_0/M08_AXI]
connect_bd_intf_net [get_bd_intf_pins SHWR_MEM0P] [get_bd_intf_pins axi_interconnect_0/M09_AXI]
connect_bd_intf_net [get_bd_intf_pins SHWR_MEM1P] [get_bd_intf_pins axi_interconnect_0/M10_AXI]
connect_bd_intf_net [get_bd_intf_pins SHWR_MEM2P] [get_bd_intf_pins axi_interconnect_0/M11_AXI]
connect_bd_intf_net [get_bd_intf_pins SHWR_MEM3P] [get_bd_intf_pins axi_interconnect_0/M12_AXI]
connect_bd_intf_net [get_bd_intf_pins SHWR_MEM4P] [get_bd_intf_pins axi_interconnect_0/M13_AXI]
connect_bd_intf_net [get_bd_intf_pins M08_AXI] [get_bd_intf_pins axi_interconnect_0/M14_AXI]
connect_bd_intf_net [get_bd_intf_pins M09_AXI] [get_bd_intf_pins axi_interconnect_0/M15_AXI]
connect_bd_intf_net [get_bd_intf_pins M10_AXI] [get_bd_intf_pins axi_interconnect_0/M16_AXI]
connect_bd_intf_net [get_bd_intf_pins M11_AXI] [get_bd_intf_pins axi_interconnect_0/M17_AXI]
connect_bd_intf_net [get_bd_intf_pins M12_AXI] [get_bd_intf_pins axi_interconnect_0/M18_AXI]
connect_bd_intf_net [get_bd_intf_pins M14_AXI] [get_bd_intf_pins axi_interconnect_0/M19_AXI]
connect_bd_intf_net [get_bd_intf_pins M20_AXI] [get_bd_intf_pins axi_interconnect_0/M20_AXI]
connect_bd_intf_net [get_bd_intf_pins M21_AXI] [get_bd_intf_pins axi_interconnect_0/M21_AXI]
connect_bd_intf_net [get_bd_intf_pins M22_AXI] [get_bd_intf_pins axi_interconnect_0/M22_AXI]
connect_bd_net [get_bd_pins proc_sys_reset_0/interconnect_aresetn] [get_bd_pins axi_interconnect_1/ARESETN]
connect_bd_net [get_bd_pins proc_sys_reset_0/peripheral_aresetn] \
  [get_bd_pins peripheral_aresetn] [get_bd_pins axi_cdma_0/s_axi_lite_aresetn] [get_bd_pins axi_interconnect_1/S00_ARESETN] \
  [get_bd_pins axi_interconnect_1/S01_ARESETN] [get_bd_pins axi_interconnect_1/M00_ARESETN] \
  [get_bd_pins axi_interconnect_1/M01_ARESETN] [get_bd_pins axi_interconnect_1/M02_ARESETN] \
  [get_bd_pins axi_interconnect_1/M03_ARESETN] [get_bd_pins axi_interconnect_1/M04_ARESETN] \
  [get_bd_pins axi_interconnect_1/M05_ARESETN] [get_bd_pins axi_interconnect_1/M06_ARESETN] \
  [get_bd_pins axi_interconnect_1/M07_ARESETN] [get_bd_pins axi_interconnect_0/S00_ARESETN] \
  [get_bd_pins axi_interconnect_0/ARESETN] [get_bd_pins axi_interconnect_0/M00_ARESETN] \
  [get_bd_pins axi_interconnect_0/M01_ARESETN] [get_bd_pins axi_interconnect_0/M02_ARESETN] \
  [get_bd_pins axi_interconnect_0/M03_ARESETN] [get_bd_pins axi_interconnect_0/M04_ARESETN] \
  [get_bd_pins axi_interconnect_0/M05_ARESETN] [get_bd_pins axi_interconnect_0/M06_ARESETN] \
  [get_bd_pins axi_interconnect_0/M07_ARESETN] [get_bd_pins axi_interconnect_0/M08_ARESETN] \
  [get_bd_pins axi_interconnect_0/M09_ARESETN] [get_bd_pins axi_interconnect_0/M10_ARESETN] \
  [get_bd_pins axi_interconnect_0/M11_ARESETN] [get_bd_pins axi_interconnect_0/M12_ARESETN] \
  [get_bd_pins axi_interconnect_0/M13_ARESETN] [get_bd_pins axi_interconnect_0/M14_ARESETN] \
  [get_bd_pins axi_interconnect_0/M15_ARESETN] [get_bd_pins axi_interconnect_0/M16_ARESETN] \
  [get_bd_pins axi_interconnect_0/M17_ARESETN] [get_bd_pins axi_interconnect_0/M18_ARESETN] \
  [get_bd_pins axi_interconnect_0/M19_ARESETN] [get_bd_pins axi_interconnect_0/M20_ARESETN] \
  [get_bd_pins axi_interconnect_0/M21_ARESETN] [get_bd_pins axi_interconnect_0/M22_ARESETN]
connect_bd_net [get_bd_pins proc_sys_reset_0/peripheral_reset] [get_bd_pins peripheral_reset]
connect_bd_net [get_bd_pins processing_system7_0/FCLK_CLK0] \
  [get_bd_pins FCLK_CLK0] [get_bd_pins proc_sys_reset_0/slowest_sync_clk] [get_bd_pins processing_system7_0/M_AXI_GP0_ACLK] \
  [get_bd_pins axi_cdma_0/m_axi_aclk] [get_bd_pins axi_cdma_0/s_axi_lite_aclk] \
  [get_bd_pins processing_system7_0/S_AXI_HP0_ACLK] [get_bd_pins axi_interconnect_1/ACLK] \
  [get_bd_pins axi_interconnect_1/S00_ACLK] [get_bd_pins axi_interconnect_1/S01_ACLK] \
  [get_bd_pins axi_interconnect_1/M00_ACLK] [get_bd_pins axi_interconnect_1/M01_ACLK] \
  [get_bd_pins axi_interconnect_1/M02_ACLK] [get_bd_pins axi_interconnect_1/M03_ACLK] \
  [get_bd_pins axi_interconnect_1/M04_ACLK] [get_bd_pins axi_interconnect_1/M05_ACLK] \
  [get_bd_pins axi_interconnect_1/M06_ACLK] [get_bd_pins axi_interconnect_1/M07_ACLK] [get_bd_pins axi_interconnect_0/ACLK] \
  [get_bd_pins axi_interconnect_0/S00_ACLK] [get_bd_pins axi_interconnect_0/M00_ACLK] \
  [get_bd_pins axi_interconnect_0/M01_ACLK] [get_bd_pins axi_interconnect_0/M02_ACLK] \
  [get_bd_pins axi_interconnect_0/M03_ACLK] [get_bd_pins axi_interconnect_0/M04_ACLK] \
  [get_bd_pins axi_interconnect_0/M05_ACLK] [get_bd_pins axi_interconnect_0/M06_ACLK] \
  [get_bd_pins axi_interconnect_0/M07_ACLK] [get_bd_pins axi_interconnect_0/M08_ACLK] \
  [get_bd_pins axi_interconnect_0/M09_ACLK] [get_bd_pins axi_interconnect_0/M10_ACLK] \
  [get_bd_pins axi_interconnect_0/M11_ACLK] [get_bd_pins axi_interconnect_0/M12_ACLK] \
  [get_bd_pins axi_interconnect_0/M13_ACLK] [get_bd_pins axi_interconnect_0/M14_ACLK] \
  [get_bd_pins axi_interconnect_0/M15_ACLK] [get_bd_pins axi_interconnect_0/M16_ACLK] \
  [get_bd_pins axi_interconnect_0/M17_ACLK] [get_bd_pins axi_interconnect_0/M18_ACLK] \
  [get_bd_pins axi_interconnect_0/M19_ACLK] [get_bd_pins axi_interconnect_0/M20_ACLK] \
  [get_bd_pins axi_interconnect_0/M21_ACLK] [get_bd_pins axi_interconnect_0/M22_ACLK]
connect_bd_net [get_bd_pins processing_system7_0/FCLK_RESET0_N] \
  [get_bd_pins proc_sys_reset_0/ext_reset_in] [get_bd_pins proc_sys_reset_0/aux_reset_in]
connect_bd_net -net trigger_memory_0_IRQ [get_bd_pins In1] [get_bd_pins xlconcat_0/In1]
connect_bd_net [get_bd_pins axi_cdma_0/cdma_introut] [get_bd_pins xlconcat_0/In0]
connect_bd_net [get_bd_pins processing_system7_0/UART0_RTSN] [get_bd_pins RADIO_RTS]
connect_bd_net [get_bd_pins RADIO_CTS] [get_bd_pins processing_system7_0/UART0_CTSN]
connect_bd_net -net In2_1 [get_bd_pins In2] [get_bd_pins xlconcat_0/In2]
connect_bd_net [get_bd_pins xlconcat_0/dout] [get_bd_pins processing_system7_0/IRQ_F2P]

current_bd_instance /adc_inputs
connect_bd_net -net In_regional_ck_0_IBUF_OUT [get_bd_pins CLK120] \
  [get_bd_pins ddr_synchronizer_24bit_0/CLK] [get_bd_pins ddr_synchronizer_24bit_1/CLK] \
  [get_bd_pins ddr_synchronizer_24bit_2/CLK] [get_bd_pins ddr_synchronizer_24bit_3/CLK] \
  [get_bd_pins ddr_synchronizer_24bit_4/CLK]
connect_bd_net -net adc2_n_1 [get_bd_pins IBUF_DS2_N] [get_bd_pins util_ds_buf_8/IBUF_DS_N]
connect_bd_net -net adc0_p_1 [get_bd_pins IBUF_DS1_P] [get_bd_pins util_ds_buf_1/IBUF_DS_P]
connect_bd_net -net adc4_n_1 [get_bd_pins IBUF_DS4_N] [get_bd_pins util_ds_buf_10/IBUF_DS_N]
connect_bd_net -net adc3_p_1 [get_bd_pins IBUF_DS3_P] [get_bd_pins util_ds_buf_6/IBUF_DS_P]
connect_bd_net -net adc1_p_1 [get_bd_pins IBUF_DS0_P] [get_bd_pins util_ds_buf_3/IBUF_DS_P]
connect_bd_net -net ADC4_CK_N_1 [get_bd_pins IBUF_CK4_N] [get_bd_pins util_ds_buf_11/IBUF_DS_N]
connect_bd_net -net ADC3_CK_P_1 [get_bd_pins IBUF_CK3_P] [get_bd_pins util_ds_buf_7/IBUF_DS_P]
connect_bd_net -net ADC2_CK_N_1 [get_bd_pins IBUF_CK2_N] [get_bd_pins util_ds_buf_5/IBUF_DS_N]
connect_bd_net -net ADC2_CK_P_1 [get_bd_pins IBUF_CK2_P] [get_bd_pins util_ds_buf_5/IBUF_DS_P]
connect_bd_net -net ddr_synchronizer_26bit_1_SYNC_OUT [get_bd_pins ddr_synchronizer_24bit_0/SYNC_OUT] [get_bd_pins SYNC_OUT0]
connect_bd_net -net ADC0_CK_N_1 [get_bd_pins IBUF_CK1_N] [get_bd_pins util_ds_buf_2/IBUF_DS_N]
connect_bd_net -net ADC4_CK_P_1 [get_bd_pins IBUF_CK4_P] [get_bd_pins util_ds_buf_11/IBUF_DS_P]
connect_bd_net -net ddr_synchronizer_26bit_3_SYNC_OUT [get_bd_pins ddr_synchronizer_24bit_3/SYNC_OUT] [get_bd_pins SYNC_OUT3]
connect_bd_net -net adc3_n_1 [get_bd_pins IBUF_DS3_N] [get_bd_pins util_ds_buf_6/IBUF_DS_N]
connect_bd_net -net adc1_n_1 [get_bd_pins IBUF_DS0_N] [get_bd_pins util_ds_buf_3/IBUF_DS_N]
connect_bd_net -net ADC3_CK_N_1 [get_bd_pins IBUF_CK3_N] [get_bd_pins util_ds_buf_7/IBUF_DS_N]
connect_bd_net -net ddr_synchronizer_26bit_2_SYNC_OUT [get_bd_pins ddr_synchronizer_24bit_2/SYNC_OUT] [get_bd_pins SYNC_OUT2]
connect_bd_net -net ddr_synchronizer_26bit_4_SYNC_OUT [get_bd_pins ddr_synchronizer_24bit_4/SYNC_OUT] [get_bd_pins SYNC_OUT4]
connect_bd_net -net adc2_p_1 [get_bd_pins IBUF_DS2_P] [get_bd_pins util_ds_buf_8/IBUF_DS_P]
connect_bd_net -net ADC1_CK_N_1 [get_bd_pins IBUF_CK0_N] [get_bd_pins util_ds_buf_4/IBUF_DS_N]
connect_bd_net -net adc0_n_2 [get_bd_pins IBUF_DS1_N] [get_bd_pins util_ds_buf_1/IBUF_DS_N]
connect_bd_net -net ADC0_CK_P_2 [get_bd_pins IBUF_CK1_P] [get_bd_pins util_ds_buf_2/IBUF_DS_P]
connect_bd_net -net ADC1_CK_P_1 [get_bd_pins IBUF_CK0_P] [get_bd_pins util_ds_buf_4/IBUF_DS_P]
connect_bd_net -net adc4_p_1 [get_bd_pins IBUF_DS4_P] [get_bd_pins util_ds_buf_10/IBUF_DS_P]
connect_bd_net [get_bd_pins util_ds_buf_3/IBUF_OUT] [get_bd_pins ddr_synchronizer_24bit_0/ASYNC_IN]
connect_bd_net [get_bd_pins util_ds_buf_4/IBUF_OUT] [get_bd_pins ddr_synchronizer_24bit_0/DDR_CLK]
connect_bd_net [get_bd_pins util_ds_buf_1/IBUF_OUT] [get_bd_pins ddr_synchronizer_24bit_1/ASYNC_IN]
connect_bd_net [get_bd_pins util_ds_buf_2/IBUF_OUT] [get_bd_pins ddr_synchronizer_24bit_1/DDR_CLK]
connect_bd_net [get_bd_pins ddr_synchronizer_24bit_1/SYNC_OUT] [get_bd_pins SYNC_OUT1]
connect_bd_net [get_bd_pins util_ds_buf_8/IBUF_OUT] [get_bd_pins ddr_synchronizer_24bit_2/ASYNC_IN]
connect_bd_net [get_bd_pins util_ds_buf_5/IBUF_OUT] [get_bd_pins ddr_synchronizer_24bit_2/DDR_CLK]
connect_bd_net [get_bd_pins util_ds_buf_6/IBUF_OUT] [get_bd_pins ddr_synchronizer_24bit_3/ASYNC_IN]
connect_bd_net [get_bd_pins util_ds_buf_7/IBUF_OUT] [get_bd_pins ddr_synchronizer_24bit_3/DDR_CLK]
connect_bd_net [get_bd_pins util_ds_buf_10/IBUF_OUT] [get_bd_pins ddr_synchronizer_24bit_4/ASYNC_IN]
connect_bd_net [get_bd_pins util_ds_buf_11/IBUF_OUT] [get_bd_pins ddr_synchronizer_24bit_4/DDR_CLK]
